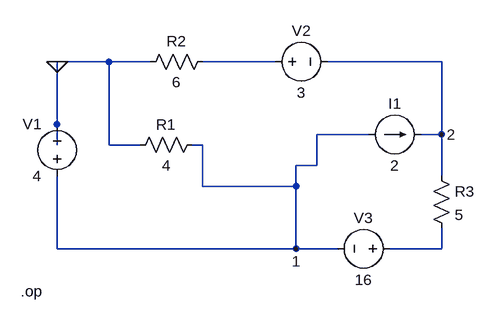
[diagram p0: schematic Draft2.asc]
Draft2.asc, the LTspice schematic file:
Version 4
SHEET 1 880 680
WIRE 96 16 16 16
WIRE 160 16 96 16
WIRE 352 16 240 16
WIRE 608 16 432 16
WIRE 16 112 16 16
WIRE 496 128 416 128
WIRE 608 128 608 16
WIRE 608 128 576 128
WIRE 16 144 16 112
WIRE 96 144 96 16
WIRE 144 144 96 144
WIRE 240 144 224 144
WIRE 416 176 416 128
WIRE 416 176 384 176
WIRE 608 192 608 128
WIRE 240 208 240 144
WIRE 384 208 384 176
WIRE 384 208 240 208
WIRE 16 304 16 192
WIRE 384 304 384 208
WIRE 384 304 16 304
WIRE 448 304 384 304
WIRE 608 304 608 272
WIRE 608 304 528 304
FLAG 608 128 2
FLAG 16 16 0
FLAG 384 304 1
SYMBOL res 128 160 R270
WINDOW 0 32 56 VTop 2
WINDOW 3 0 56 VBottom 2
SYMATTR InstName R1
SYMATTR Value 4
SYMBOL res 256 0 R90
WINDOW 0 0 56 VBottom 2
WINDOW 3 32 56 VTop 2
SYMATTR InstName R2
SYMATTR Value 6
SYMBOL voltage 336 16 R270
WINDOW 0 32 56 VTop 2
WINDOW 3 -32 56 VBottom 2
SYMATTR InstName V2
SYMATTR Value 3
SYMBOL current 496 128 R270
WINDOW 0 32 40 VTop 2
WINDOW 3 -32 40 VBottom 2
SYMATTR InstName I1
SYMATTR Value 2
SYMBOL voltage 544 304 R90
WINDOW 0 -32 56 VBottom 2
WINDOW 3 32 56 VTop 2
SYMATTR InstName V3
SYMATTR Value 16
SYMBOL res 592 176 R0
SYMATTR InstName R3
SYMATTR Value 5
SYMBOL voltage 16 208 R180
WINDOW 0 24 96 Left 2
WINDOW 3 24 16 Left 2
SYMATTR InstName V1
SYMATTR Value 4
TEXT -40 370 Left 2 !.op

The netlist it stands for:
* Draft2.asc
R1 0 1 4
R2 N001 0 6
V2 N001 2 3
I1 1 2 2
V3 N002 1 16
R3 2 N002 5
V1 1 0 4
.op
.backanno
.end